# Altium schematic sheet DebuggerMCU.SchDoc
size A4
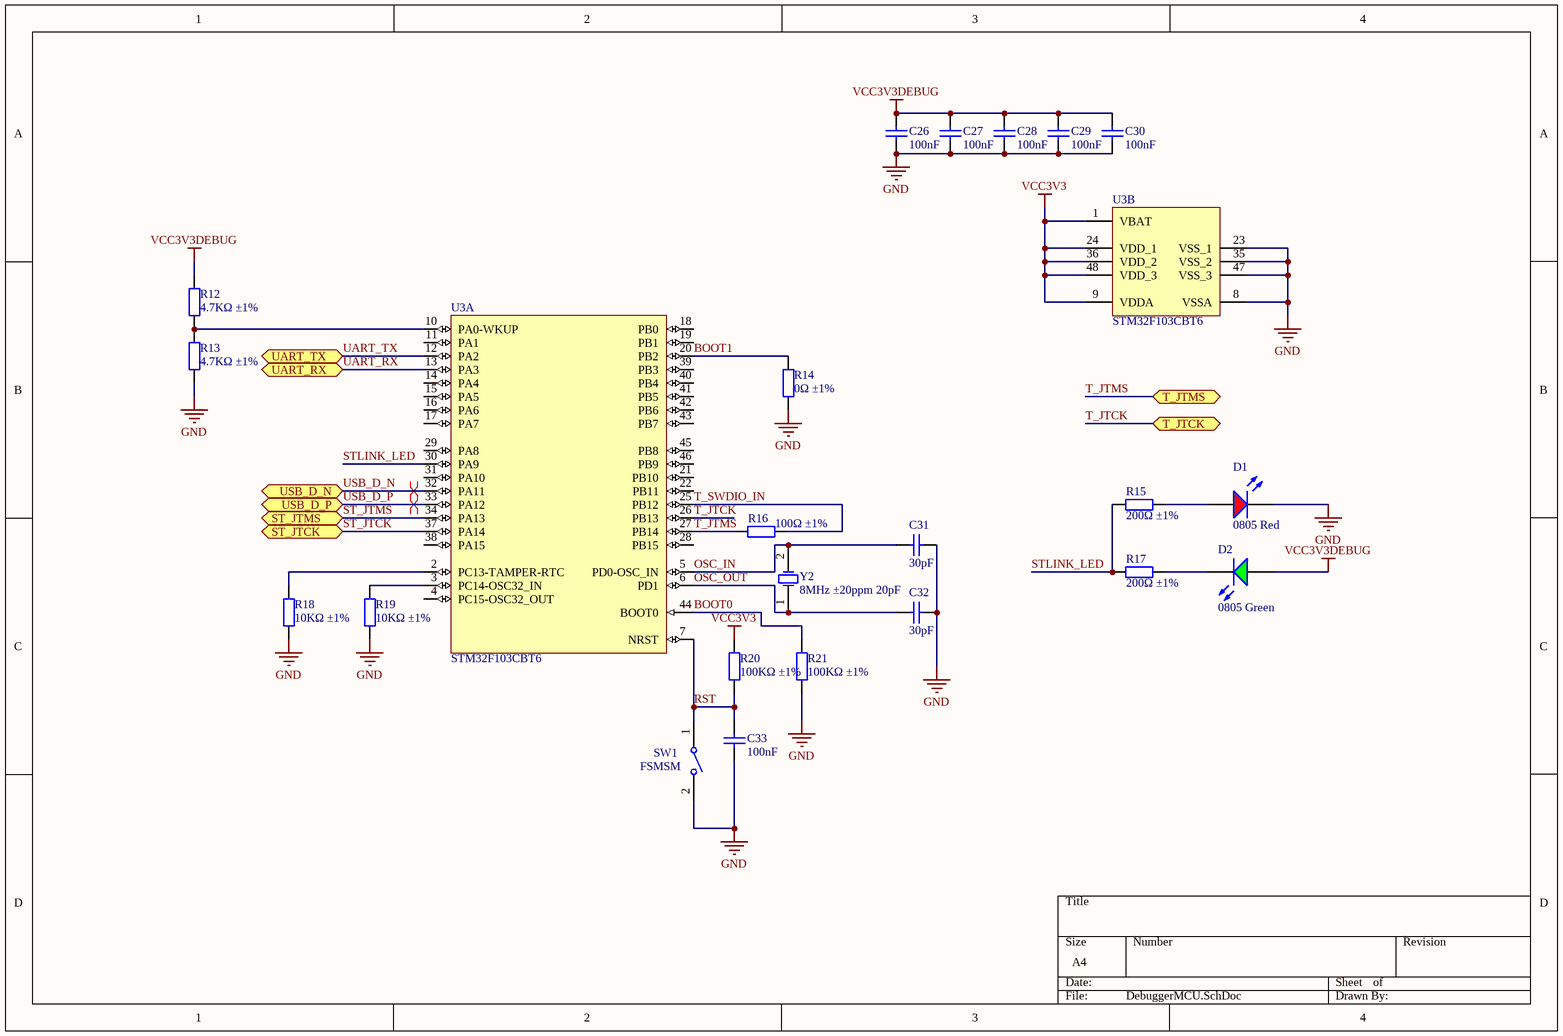
[diagram p0: DebuggerMCU.SchDoc]

## Parts
C26  100nF  [0402_C]
C27  100nF  [0402_C]
C28  100nF  [0402_C]
C29  100nF  [0402_C]
C30  100nF  [0402_C]
C31  30pF  [0402_C]
C32  30pF  [0402_C]
C33  100nF  [0402_C]
D1  0805 Red  [0805_LED_S1]
D2  0805 Green  [0805_LED_S1]
R12  4.7KΩ ±1%  [0805_R]
R13  4.7KΩ ±1%  [0805_R]
R14  0Ω ±1%  [0402_R]
R15  200Ω ±1%  [0402_R]
R16  100Ω ±1%  [0402_R]
R17  200Ω ±1%  [0402_R]
R18  10KΩ ±1%  [0402_R]
R19  10KΩ ±1%  [0402_R]
R20  100KΩ ±1%  [0402_R]
R21  100KΩ ±1%  [0402_R]
SW1  FSMSM  [TECO-FSMSM-2_V]
U3  STM32F103CBT6  [LQFP-48_7x7x05P]  (parts A,B of 2)
Y2  8MHz ±20ppm 20pF  [SMD-5032_2P]

## Ports
ST_JTCK (bidir), ST_JTMS (bidir), T_JTCK (bidir), T_JTMS (bidir), UART_RX (bidir), UART_TX (bidir), USB_D_N (bidir), USB_D_P (bidir)

## Nets
GND: C26.1 C27.1 C28.1 C29.1 C30.1 C31.2 C32.2 C33.1 D1.K R13.1 R14.1 R18.1 R19.1 R21.1 SW1.2 U3.8(VSSA) U3.23(VSS_1) U3.35(VSS_2) U3.47(VSS_3)
VCC3V3: R20.2 U3.1(VBAT) U3.9(VDDA) U3.24(VDD_1) U3.36(VDD_2) U3.48(VDD_3)
VCC3V3DEBUG: C26.2 C27.2 C28.2 C29.2 C30.2 D2.A R12.2
BOOT0: R21.2 U3.44(BOOT0)
BOOT1: R14.2 U3.20(PB2)
OSC_IN: C31.1 U3.5(PD0-OSC_IN) Y2.2(OSC2)
OSC_OUT: C32.1 U3.6(PD1) Y2.1(OSC1)
RST: C33.2 R20.1 SW1.1 U3.7(NRST)
ST_JTCK: U3.37(PA14) ; port ST_JTCK
ST_JTMS: U3.34(PA13) ; port ST_JTMS
STLINK_LED: R15.1 R17.1 U3.30(PA9)
T_JTCK: U3.26(PB13) ; port T_JTCK
T_JTMS: R16.2 U3.27(PB14) ; port T_JTMS
T_SWDIO_IN: R16.1 U3.25(PB12)
UART_RX: U3.13(PA3) ; port UART_RX
UART_TX: U3.12(PA2) ; port UART_TX
USB_D_N: U3.32(PA11) ; port USB_D_N
USB_D_P: U3.33(PA12) ; port USB_D_P
NetD1_A: D1.A R15.2
NetD2_K: D2.K R17.2
NetR12_1: R12.1 R13.2 U3.10(PA0-WKUP)
NetR18_2: R18.2 U3.2(PC13-TAMPER-RTC)
NetR19_2: R19.2 U3.3(PC14-OSC32_IN)

Not connected (* = marked no-connect by the designer): U3 4(PC15-OSC32_OUT) 11(PA1) 14(PA4) 15(PA5) 16(PA6) 17(PA7) 18(PB0) 19(PB1) 21(PB10) 22(PB11) 28(PB15) 29(PA8) 31(PA10) 38(PA15) 39(PB3) 40(PB4) 41(PB5) 42(PB6) 43(PB7) 45(PB8) 46(PB9)

## Layout directives
differential pair: USB_D_N, USB_D_P

## Library data of the parts
C26-C30 C33 = 0402 100nF (104) 10% 16V: Chip capacitors; Manufacturer: Samsung Electro-Mechanics; PartNumber: CL05B104KO5NNNC; Tolerance: 10%; Voltage: 16V; ComponentLink1Description: Supplier link; ComponentLink1URL: http://www.szlcsc.com/product/details_1877.html; Package: 0402; Supplier: LC; SuppliersPartNumber: C1525; Capacitance: 100nF
C31 C32 = 0402 30pF (300) 5% 50V: Chip capacitors; Manufacturer: Guangdong Fenghua Advanced Tech; PartNumber: 0402CG300J500NT; Tolerance: 5%; Voltage: 50V; ComponentLink1Description: Supplier link; ComponentLink1URL: http://www.szlcsc.com/product/details_1922.html; Package: 0402; Supplier: LC; SuppliersPartNumber: C1570; Capacitance: 30pF
D1 = 0805 LED Red: LED; ComponentLink1Description: 供应商链接; ComponentLink1URL: http://www.szlcsc.com/product/details_2668.html; Package: 0805; Supplier: LC; SuppliersPartNumber: C2295; Color: Red
D2 = 0805 LED Green: LED; ComponentLink1Description: 供应商链接; ComponentLink1URL: http://www.szlcsc.com/product/details_2670.html; Package: 0805; Supplier: LC; SuppliersPartNumber: C2297; Color: Green
R12 R13 = 0805 4.7K (4701) 1%: Chip resistor; Manufacturer: Uniroyal Elec; Power: 1/8W; ComponentLink1Description: Supplier link; ComponentLink1URL: http://www.szlcsc.com/product/details_18361.html; Package: 0805; Supplier: LC; SuppliersPartNumber: C17673; Tolerance: 1%
R14 = 0402 0R (0R0) 1%: Chip resistor; Manufacturer: Uniroyal Elec; PartNumber: 0402WGF0000TCE; Power: 1/16W; ComponentLink1Description: Supplier link; ComponentLink1URL: http://www.szlcsc.com/product/details_17853.html; Package: 0402; Supplier: LC; SuppliersPartNumber: C17168; Resistance: 0Ω; Tolerance: 1%
R15 R17 = 0402 200R (2000) 1%: Chip resistor; Manufacturer: Uniroyal Elec; PartNumber: 0402WGF2000TCE; Power: 1/16W; ComponentLink1Description: Supplier link; ComponentLink1URL: http://www.szlcsc.com/product/details_25830.html; Package: 0402; Supplier: LC; SuppliersPartNumber: C25087; Resistance: 200Ω; Tolerance: 1%
R16 = 0402 100R (1000) 1%: Chip resistor; Manufacturer: Uniroyal Elec; PartNumber: 0402WGF1000TCE; Power: 1/16W; ComponentLink1Description: Supplier link; ComponentLink1URL: http://www.szlcsc.com/product/details_25819.html; Package: 0402; Supplier: LC; SuppliersPartNumber: C25076; Resistance: 100Ω; Tolerance: 1%
R18 R19 = 0402 10K (1002) 1%: Chip resistor; Manufacturer: Uniroyal Elec; PartNumber: 0402WGF1002TCE; Power: 1/16W; ComponentLink1Description: Supplier link; ComponentLink1URL: http://www.szlcsc.com/product/details_26487.html; Package: 0402; Supplier: LC; SuppliersPartNumber: C25744; Resistance: 10KΩ; Tolerance: 1%
R20 R21 = 0402 100K (1003) 1%: Chip resistor; Manufacturer: Uniroyal Elec; PartNumber: 0402WGF1003TCE; Power: 1/16W; ComponentLink1Description: Supplier link; ComponentLink1URL: http://www.szlcsc.com/product/details_26484.html; Package: 0402; Supplier: LC; SuppliersPartNumber: C25741; Resistance: 100KΩ; Tolerance: 1%
SW1 = CMP-2000-07511-1: FSMSM Push Button Switch, 50 mA, -35 to 85 degC, 2-Pin SMD, RoHS, Bulk; Manufacturer: TE Connectivity; Actuator Length: 1.07mm; Electrical Life: 20000Cycles; Actuator Material: Polyamide; Current Rating: 50mA; Illumination Type: Illuminated; Voltage Rating (DC): 24V; Contact Resistance: 100mOhm; Case\/Package: SMD/SMT; Operating Force: 180gf; Switch Travel: 0.25mm; Max Voltage Rating (DC): 12V; Throw Configuration: SPST; Packaging: LoosePiece; Max Operating Temperature: 85degC; ELV: Compliant; Package Description: 2-Pin Surface Mount Device, Body 6 x 3.5 mm, Pitch 9.19 mm; RoHSCompliant: true; Manufacturer URL: http://www.te.com/; Contact Plating: Silver; Contact Material: Brass; Mounting Technology: SurfaceMount; Contact Current Rating: 50mA; Datasheet Version: Rev. C2, 08/2014; Datasheet URL: http://www.te.com/commerce/DocumentDelivery/DDEController?Action=showdoc&DocId=Customer+Drawing%7F1437566-3%7FC2%7Fpdf%7FEnglish%7FENG_CD_1437566-3_C2_1437566_3_1_c.dwg.pdf%7F1437566-3; Mechanical Life: 20000Cycles; Package Reference: FSMSM; REACH SVHC: Unknown; Orientation: Straight; Min Operating Temperature: -35degC; Lead Free: LeadFree; Termination: GullWing; Package Quantity: 1000; Mount: SurfaceMount
U3 = STM32F103CBT6: ARM; ComponentLink1Description: 供应商链接; ComponentLink1URL: http://www.szlcsc.com/product/details_8796.html; Package: LQFP-48_7x7x05P; Supplier: LC; SuppliersPartNumber: C8304
Y2 = SMD-5032_2P 8MHz 20ppm 20pF: 贴片晶振; ComponentLink1Description: 供应商链接; ComponentLink1URL: http://www.szlcsc.com/product/details_117214.html; Package: SMD-5032_2P; Supplier: LC; SuppliersPartNumber: C115962